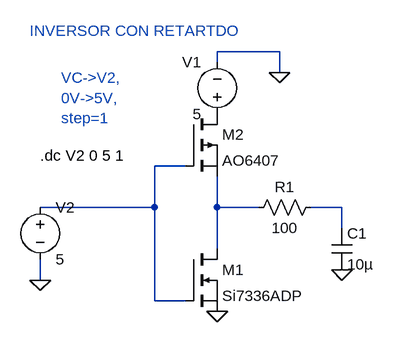
[diagram p0: schematic Inversor.asc]
Inversor.asc, the LTspice schematic file:
Version 4.1
SHEET 1 880 680
WIRE 336 -240 240 -240
WIRE 240 -224 240 -240
WIRE 336 -208 336 -240
WIRE 192 -64 144 -64
WIRE 144 0 144 -64
WIRE 144 0 -32 0
WIRE 240 0 240 -48
WIRE 304 0 240 0
WIRE 432 0 384 0
WIRE 432 32 432 0
WIRE 240 64 240 0
WIRE -32 112 -32 80
WIRE 144 144 144 0
WIRE 192 144 144 144
FLAG 432 96 0
FLAG 240 160 0
FLAG 336 -208 0
FLAG -32 112 0
SYMBOL nmos 192 64 R0
SYMATTR InstName M1
SYMATTR Value Si7336ADP
SYMBOL pmos 192 -144 R0
SYMATTR InstName M2
SYMATTR Value AO6407
SYMBOL res 400 -16 R90
WINDOW 0 0 56 VBottom 2
WINDOW 3 32 56 VTop 2
SYMATTR InstName R1
SYMATTR Value 100
SYMBOL cap 416 32 R0
SYMATTR InstName C1
SYMATTR Value 10µ
SYMBOL voltage 240 -128 R180
WINDOW 0 24 96 Left 2
WINDOW 3 24 16 Left 2
WINDOW 123 0 0 Left 0
WINDOW 39 0 0 Left 0
SYMATTR InstName V1
SYMATTR Value 5
SYMBOL voltage -32 -16 R0
WINDOW 123 0 0 Left 0
WINDOW 39 0 0 Left 0
SYMATTR InstName V2
SYMATTR Value 5
TEXT -48 -272 Left 2 ;INVERSOR CON RETARTDO
TEXT -32 -80 Left 2 !.dc V2 0 5 1
TEXT 0 -200 Left 2 ;VC->V2, \n0V->5V, \nstep=1

The netlist it stands for:
* Inversor.asc
M1 N002 N001 0 0 Si7336ADP
M2 P001 N001 N002 N002 AO6407
R1 N003 N002 100
C1 N003 0 10µ
V1 P001 0 5
V2 N001 0 5
.model NMOS NMOS
.model PMOS PMOS
.lib standard.mos
* INVERSOR CON RETARTDO
.dc V2 0 5 1
* VC->V2,
* 0V->5V,
* step=1
.backanno
.end